# Altium schematic sheet Net Names 2.SchDoc
size A4; SheetNumber: 2; SheetTotal: 3
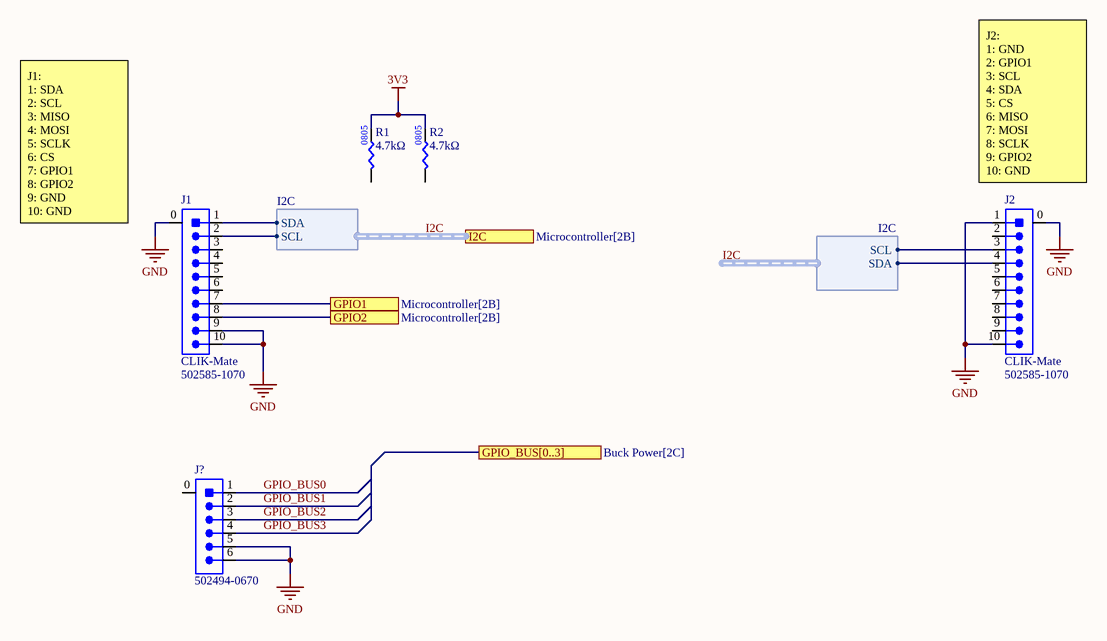
[diagram p0: Net Names 2.SchDoc]

## Parts
J1  Family: CLIK-Mate  Manufacturer Part Number 1: 502585-1070  [MOLEX-5025851070]  (hidden comment: CON_10M_SM_RA)
J2  Family: CLIK-Mate  Manufacturer Part Number 1: 502585-1070  [MOLEX-5025851070]  (hidden comment: CON_10M_SM_RA)
J?  Manufacturer Part Number 1: 502494-0670  [MOLEX-5024940670]  (hidden comment: CON_6M_SM_RA)
R1  value 4.7kΩ  [RES0805]  (hidden comment: RES_4.7kΩ_0805_5%)
R2  value 4.7kΩ  [RES0805]  (hidden comment: RES_4.7kΩ_0805_5%)

## Ports
GPIO1 (see Microcontroller[2B]), GPIO2 (see Microcontroller[2B]), GPIO_BUS[0..3] (see Buck Power[2C]), I2C (harness I2C, see Microcontroller[2B])

## Harnesses
I2C: SDA, SCL

## Nets
3V3: R1.2 R2.2
GND: J1.0 J1.9 J1.10 J2.0 J2.1 J2.10 J?.5 J?.6
GPIO1: J1.7 ; port GPIO1
GPIO2: J1.8 ; port GPIO2
GPIO_BUS0: J?.1
GPIO_BUS1: J?.2
GPIO_BUS2: J?.3
GPIO_BUS3: J?.4
I2C.SCL: J1.2 J2.3 ; port I2C.SCL
I2C.SDA: J1.1 J2.4 ; port I2C.SDA

Not connected (* = marked no-connect by the designer): J1 3 4 5 6; J2 2 5 6 7(6) 8(6) 9; J? 0; R1 1; R2 1

## Buses and harness runs
harness I2C = port I2C

## Notes on the sheet
- (near J2) J2:
  1: GND
  2: GPIO1
  3: SCL
  4: SDA
  5: CS
  6: MISO
  7: MOSI
  8: SCLK
  9: GPIO2
  10: GND
- J1:
  1: SDA
  2: SCL
  3: MISO
  4: MOSI
  5: SCLK
  6: CS
  7: GPIO1
  8: GPIO2
  9: GND
  10: GND

## Library data of the parts
J1 J2 = CON_10M_SM_RA: CONN HEADER SMD RIGHT ANGLE 1.5 MM PITCH; Manufacturer 1: Molex; Current Rating: 2A; Voltage Rating: 100V; Pitch: 1.5mm; Supplier 1: Digi-Key; Supplier Part Number 1: WM14472CT-ND; Orientation: Right Angle
J? = CON_6M_SM_RA: CONN HEADER SMD RIGHT ANGLE 2MM PITCH; Manufacturer 1: Molex; Current Rating: 3A; Voltage Rating: 250V; Supplier 1: Digi-Key; Orientation: Right Angle; Pitch: 2mm; Supplier Part Number 1: WM2283CT-ND
R1 R2 = RES_4.7kΩ_0805_5%: RES 4.7K OHM 5% 1/8W 0805; Manufacturer 1: Yageo; Manufacturer Part Number 1: RC0805JR-074K7L; Supplier 1: Digi-Key; Supplier Part Number 1: 311-4.7KARCT-ND; Mounting Type: SMD; LCSC Part #: C17673; Package: 0805